# Altium schematic sheet 原理图.SchDoc
size A2
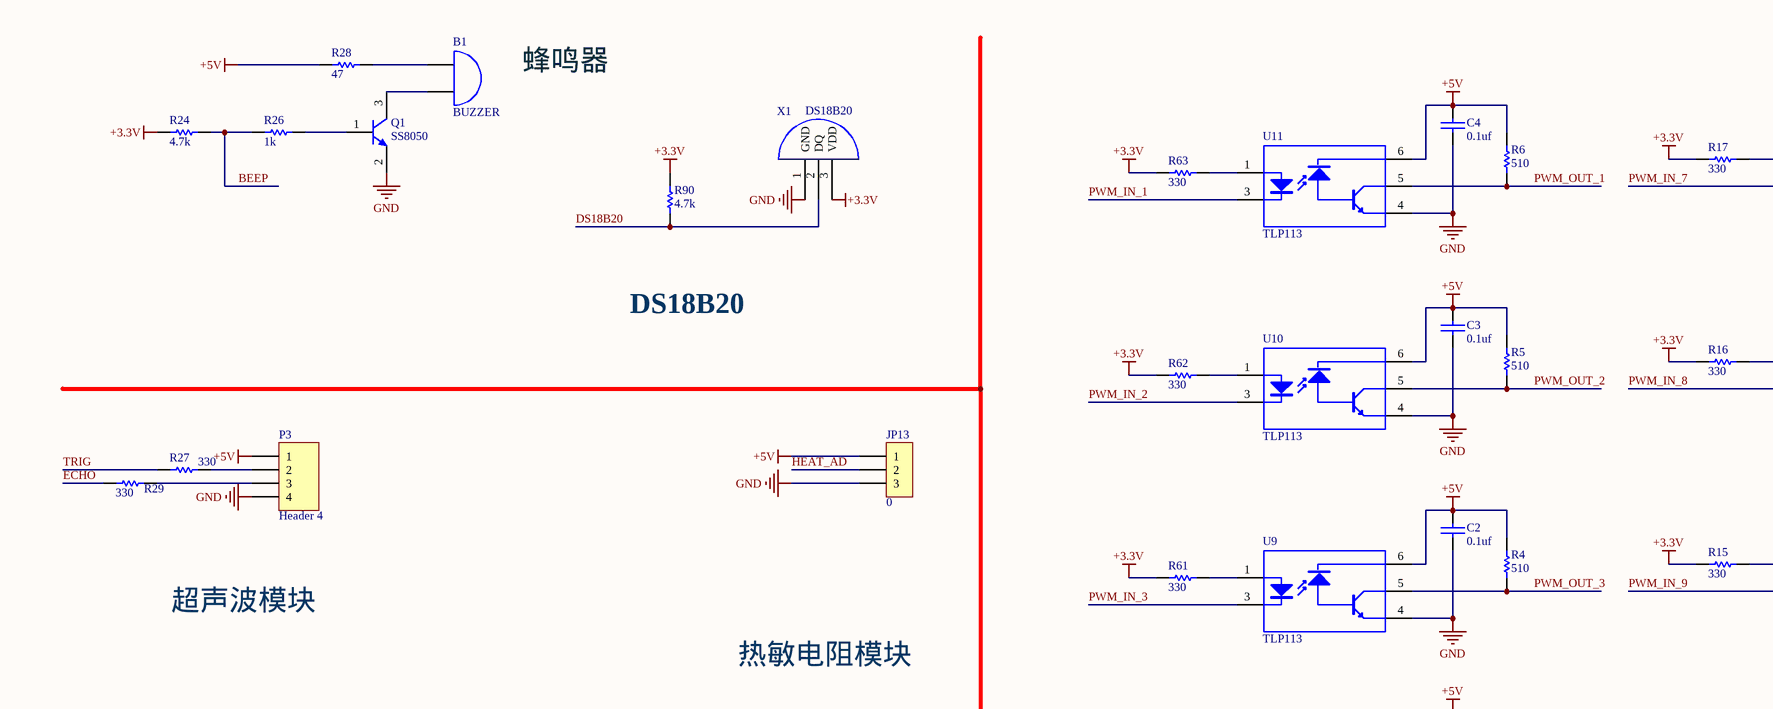
[diagram p0: 原理图.SchDoc, top left]
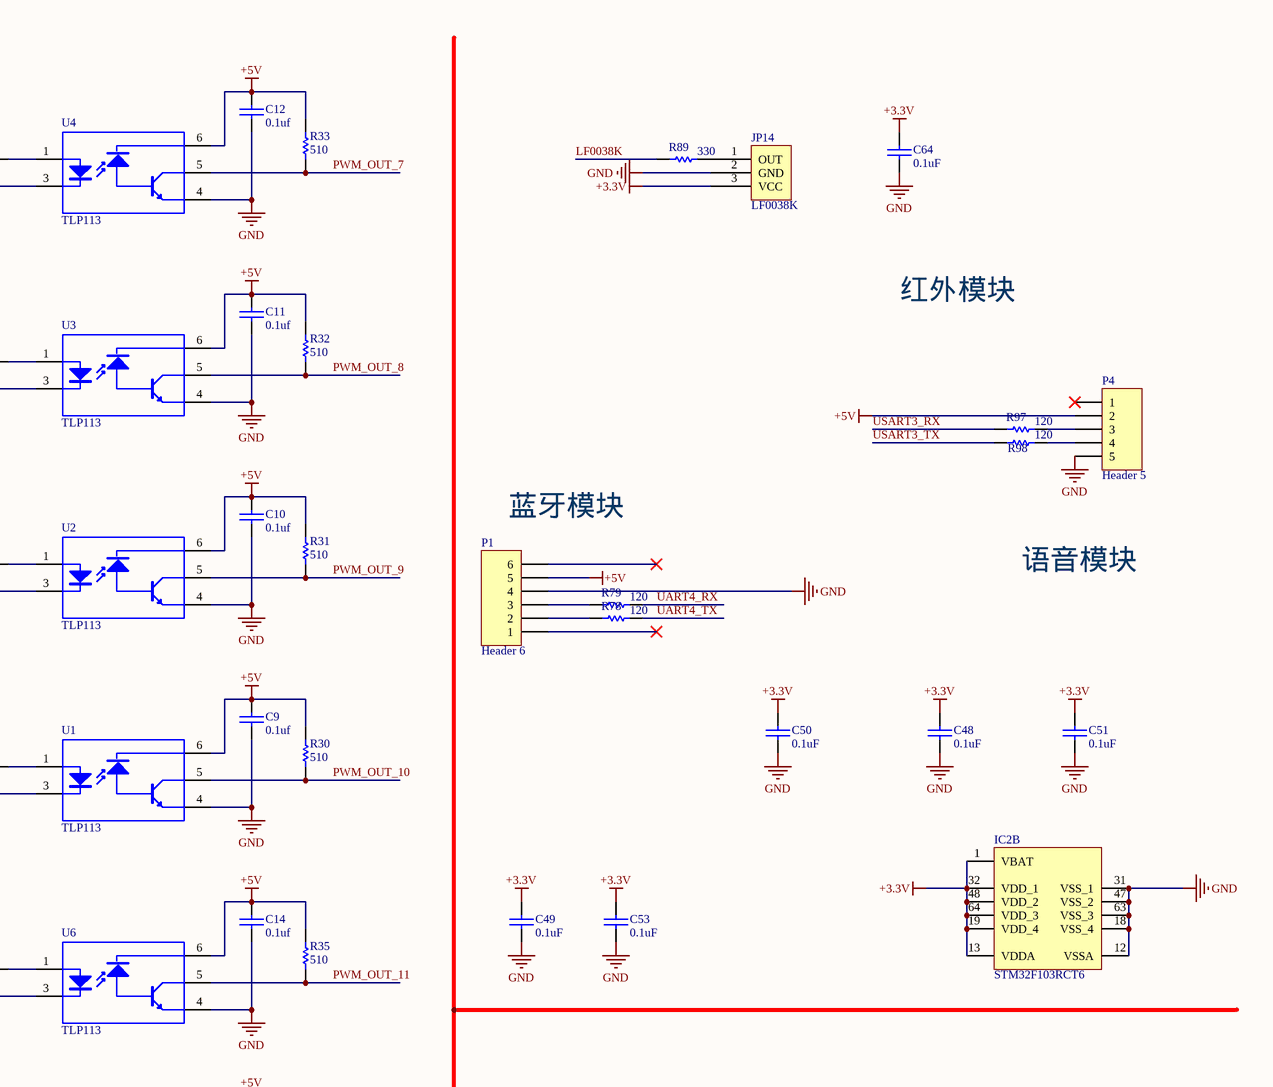
[diagram p1: 原理图.SchDoc, top right]
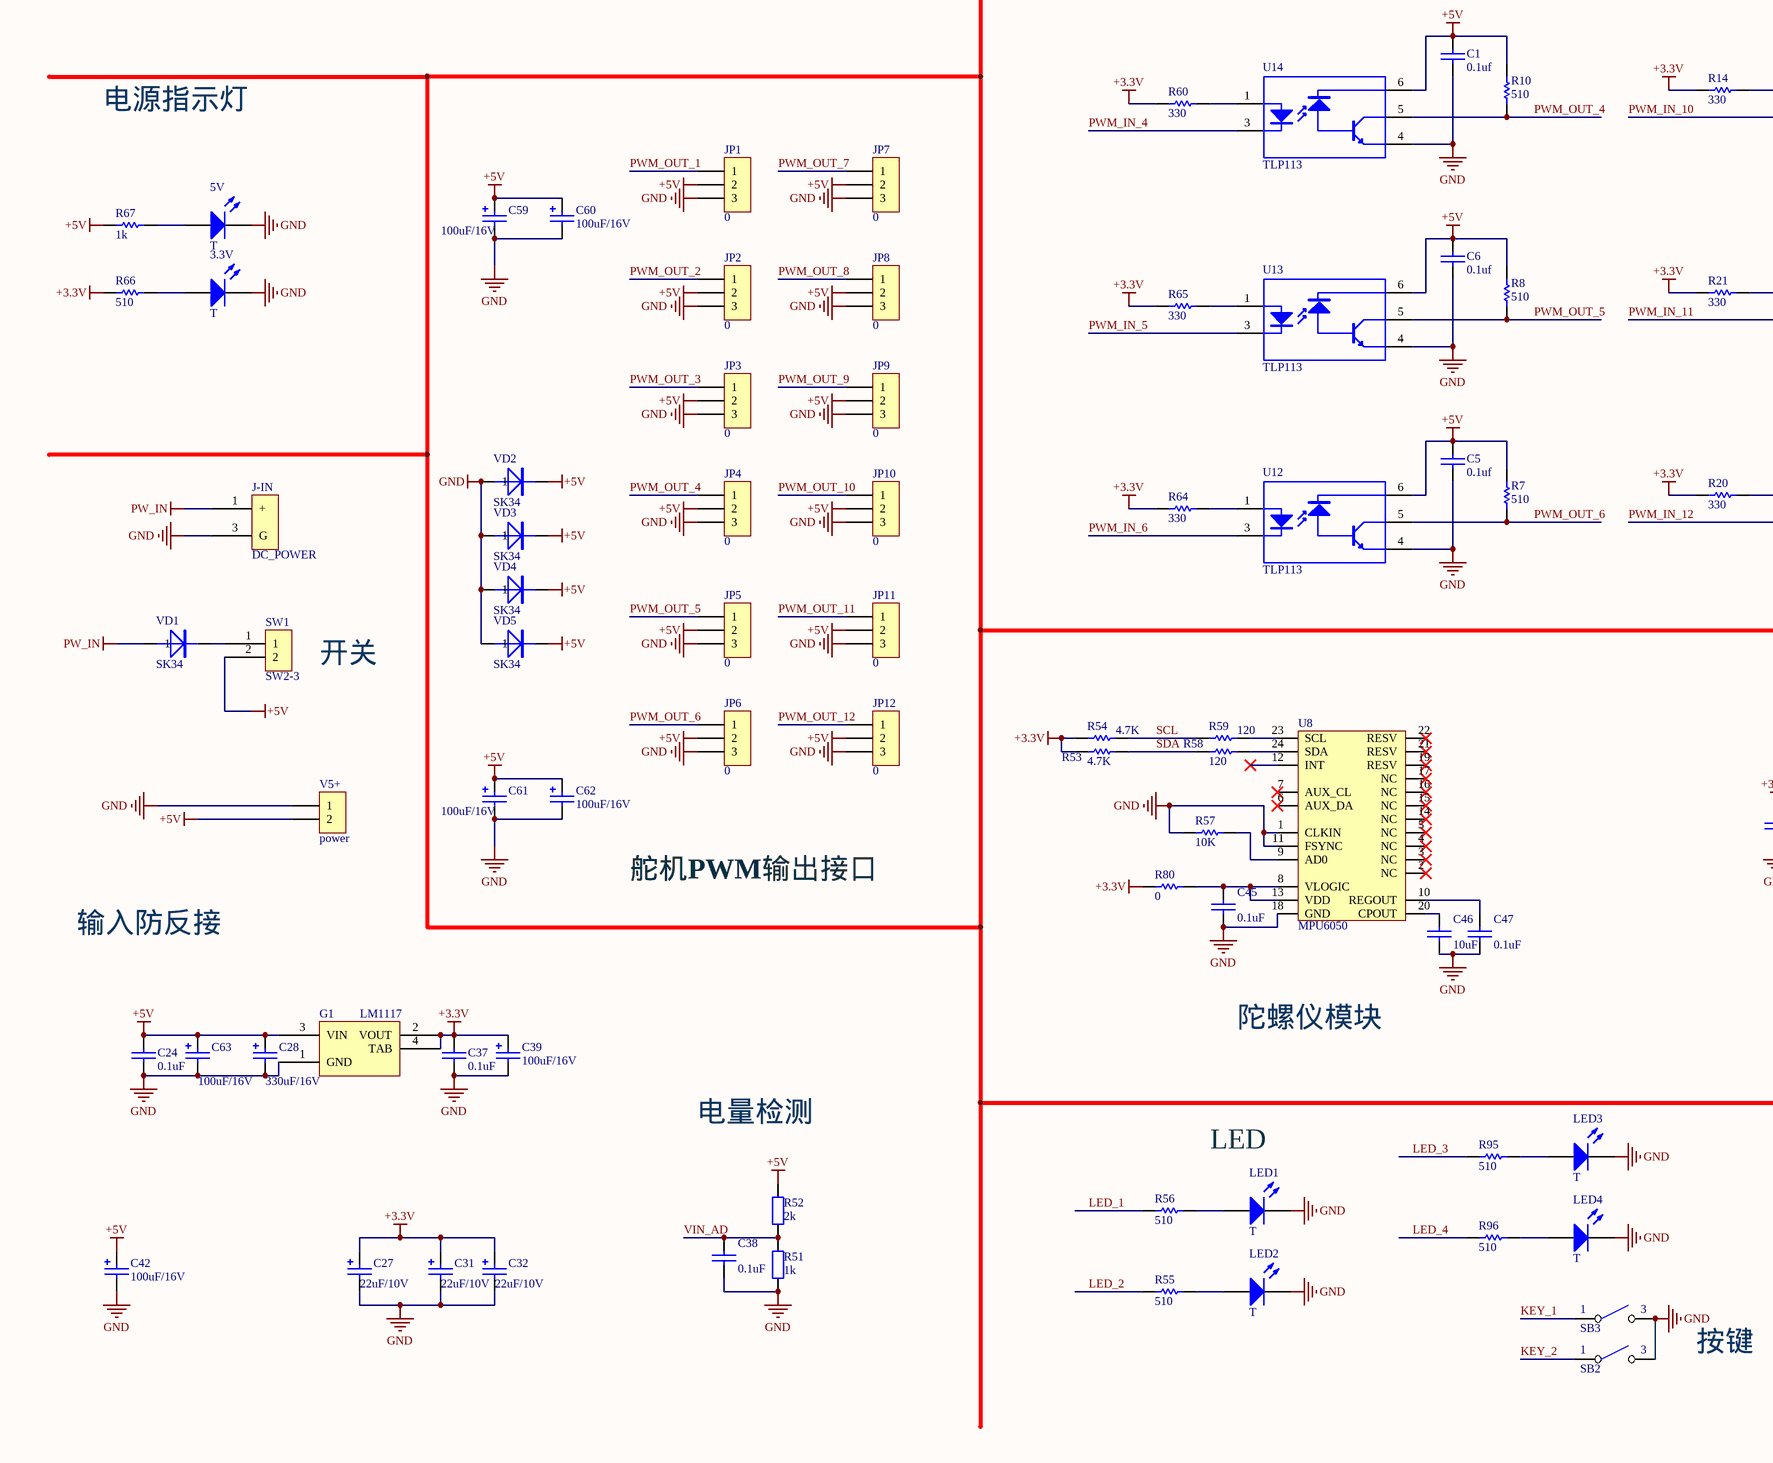
[diagram p2: 原理图.SchDoc, bottom left]
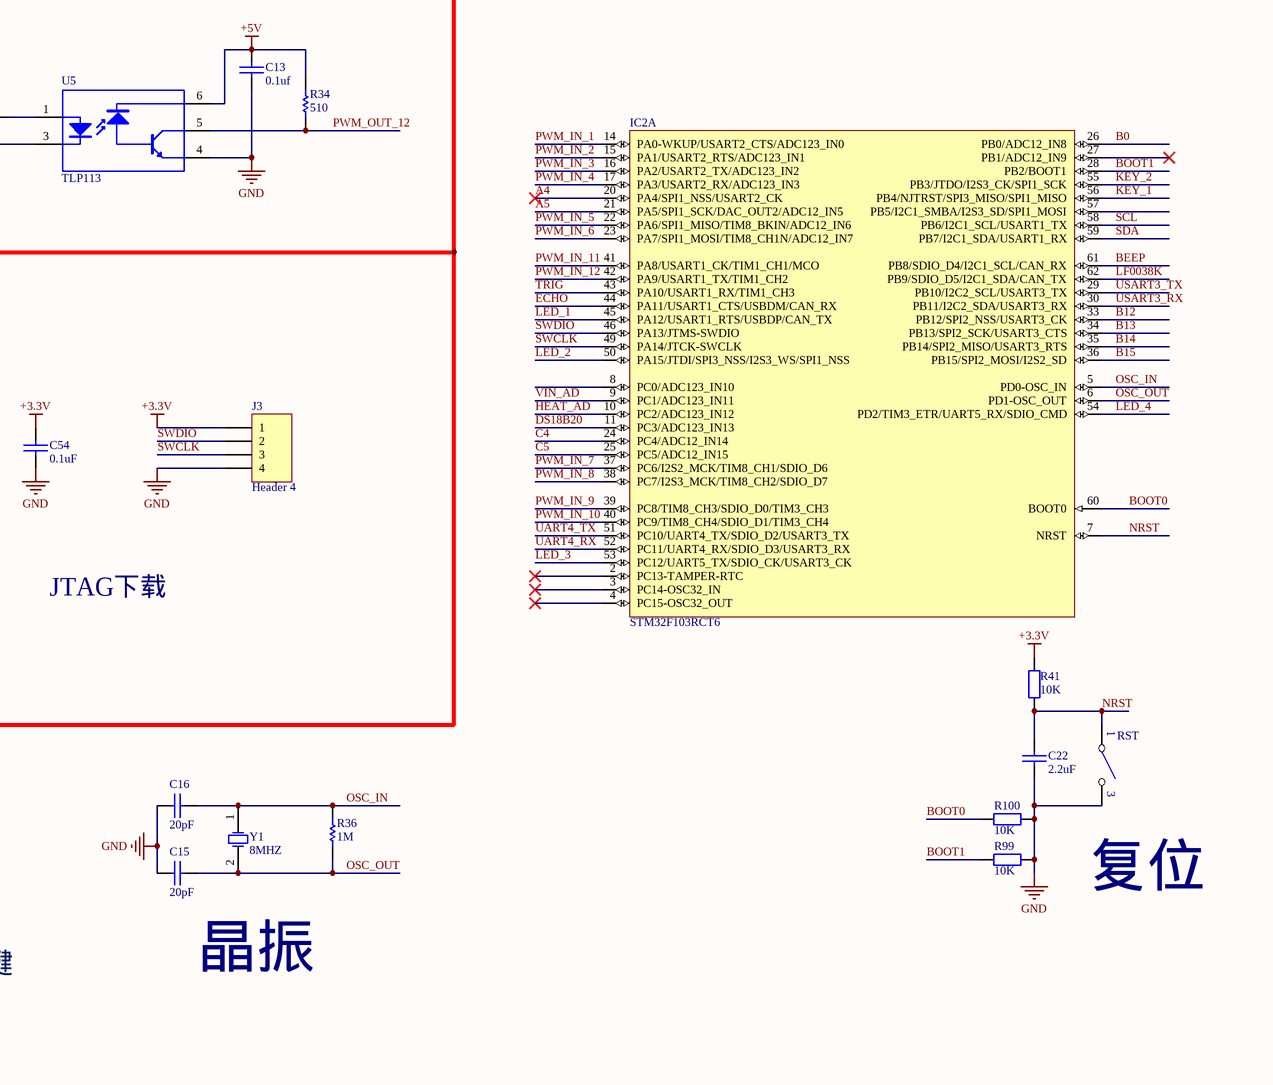
[diagram p3: 原理图.SchDoc, bottom right]

## Parts
3.3V  T  [LED-0805]
5V  T  [LED-0805]
B1  BUZZER  [BUZZER-5V]
C1  0.1uf  [0805]
C2  0.1uf  [0805]
C3  0.1uf  [0805]
C4  0.1uf  [0805]
C5  0.1uf  [0805]
C6  0.1uf  [0805]
C9  0.1uf  [0805]
C10  0.1uf  [0805]
C11  0.1uf  [0805]
C12  0.1uf  [0805]
C13  0.1uf  [0805]
C14  0.1uf  [0805]
C15  20pF  [0805]
C16  20pF  [0805]
C22  2.2uF  [0805]
C24  0.1uF  [0805]
C27  22uF/10V  [3528-B]
C28  330uF/16V  [CSMD-100U50V]
C31  22uF/10V  [3528-B]
C32  22uF/10V  [3528-B]
C37  0.1uF  [0805]
C38  0.1uF  [0805]
C39  100uF/16V  [7243-D]
C42  100uF/16V  [7243-D]
C45  0.1uF  [0805]
C46  10uF  [0805]
C47  0.1uF  [0805]
C48  0.1uF  [0805]
C49  0.1uF  [0805]
C50  0.1uF  [0805]
C51  0.1uF  [0805]
C53  0.1uF  [0805]
C54  0.1uF  [0805]
C59  100uF/16V  [7243-D]
C60  100uF/16V  [7243-D]
C61  100uF/16V  [7243-D]
C62  100uF/16V  [7243-D]
C63  100uF/16V  [7243-D]
C64  0.1uF  [0805]
G1  LM1117  [SOT223-2.3]
IC2  STM32F103RCT6  [TQFP64-0.5]  (parts A,B of 2)
J3  Header 4  [HDR1X4]
J-IN  DC_POWER  [DC-005 5.5-2.1]
JP1  0  [SIP3-2.54]
JP2  0  [SIP3-2.54]
JP3  0  [SIP3-2.54]
JP4  0  [SIP3-2.54]
JP5  0  [SIP3-2.54]
JP6  0  [SIP3-2.54]
JP7  0  [SIP3-2.54]
JP8  0  [SIP3-2.54]
JP9  0  [SIP3-2.54]
JP10  0  [SIP3-2.54]
JP11  0  [SIP3-2.54]
JP12  0  [SIP3-2.54]
JP13  0  [SIP3-2.54]
JP14  LF0038K  [LF0038K]
LED1  T  [LED-0805]
LED2  T  [LED-0805]
LED3  T  [LED-0805]
LED4  T  [LED-0805]
P1  Header 6  [HDR1X6]
P3  Header 4  [HDR1X4]
P4  Header 5  [HDR1X5]
Q1  SS8050  [SOT-23]
R4  510  [0805]
R5  510  [0805]
R6  510  [0805]
R7  510  [0805]
R8  510  [0805]
R10  510  [0805]
R14  330  [0805]
R15  330  [0805]
R16  330  [0805]
R17  330  [0805]
R20  330  [0805]
R21  330  [0805]
R24  4.7k  [0805]
R26  1k  [0805]
R27  330  [0805]
R28  47  [0805]
R29  330  [0805]
R30  510  [0805]
R31  510  [0805]
R32  510  [0805]
R33  510  [0805]
R34  510  [0805]
R35  510  [0805]
R36  1M  [0805]
R41  10K  [0805]
R51  1k  [0805]
R52  2k  [0805]
R53  4.7K  [0805]
R54  4.7K  [0805]
R55  510  [0805]
R56  510  [0805]
R57  10K  [0805]
R58  120  [0805]
R59  120  [0805]
R60  330  [0805]
R61  330  [0805]
R62  330  [0805]
R63  330  [0805]
R64  330  [0805]
R65  330  [0805]
R66  510  [0805]
R67  1k  [0805]
R78  120  [0805]
R79  120  [0805]
R80  0  [0805]
R89  330  [0805]
R90  4.7k  [0805]
R95  510  [0805]
R96  510  [0805]
R97  120  [0805]
R98  120  [0805]
R99  10K  [0805]
R100  10K  [0805]
RST  Config  [KEY-SMD]  (value not drawn)
SB2  Config  [KEY-SMD]  (value not drawn)
SB3  Config  [KEY-SMD]  (value not drawn)
SW1  SW2-3  [SS-12F44(1P2T)]
U1  TLP113  [MFSOP6-5]
U2  TLP113  [MFSOP6-5]
U3  TLP113  [MFSOP6-5]
U4  TLP113  [MFSOP6-5]
U5  TLP113  [MFSOP6-5]
U6  TLP113  [MFSOP6-5]
U8  MPU6050  [QFN24]
U9  TLP113  [MFSOP6-5]
U10  TLP113  [MFSOP6-5]
U11  TLP113  [MFSOP6-5]
U12  TLP113  [MFSOP6-5]
U13  TLP113  [MFSOP6-5]
U14  TLP113  [MFSOP6-5]
V5+  power  [MKDS2-5.08]
VD1  SK34  [SK34-DIODE]
VD2  SK34  [SK34-DIODE]
VD3  SK34  [SK34-DIODE]
VD4  SK34  [SK34-DIODE]
VD5  SK34  [SK34-DIODE]
X1  DS18B20  [DS18B20TR]
Y1  8MHZ  [CRYSTAL-2PIN]

## Nets
+3.3V: C27.1 C31.1 C32.1 C37.1 C39.1 C48.1 C49.1 C50.1 C51.1 C53.1 C54.1 C64.1 G1.2(VOUT) G1.4(TAB) IC2.1(VBAT) IC2.13(VDDA) IC2.19(VDD_4) IC2.32(VDD_1) IC2.48(VDD_2) IC2.64(VDD_3) J3.1 JP14.3(VCC) R14.1 R15.1 R16.1 R17.1 R20.1 R21.1 R24.1 R41.2 R53.1 R54.1 R60.1 R61.1 R62.1 R63.1 R64.1 R65.1 R66.1 R80.1 R90.2 X1.3(VDD)
+5V: C1.1 C2.1 C3.1 C4.1 C5.1 C6.1 C9.1 C10.1 C11.1 C12.1 C13.1 C14.1 C24.1 C28.1 C42.1 C59.1 C60.1 C61.1 C62.1 C63.1 G1.3(VIN) JP1.2 JP2.2 JP3.2 JP4.2 JP5.2 JP6.2 JP7.2 JP8.2 JP9.2 JP10.2 JP11.2 JP12.2 JP13.1 P1.5 P3.1 P4.2 R4.2 R5.2 R6.2 R7.2 R8.2 R10.2 R28.1 R30.2 R31.2 R32.2 R33.2 R34.2 R35.2 R52.1 R67.1 SW1.2 U1.6(VCC) U2.6(VCC) U3.6(VCC) U4.6(VCC) U5.6(VCC) U6.6(VCC) U9.6(VCC) U10.6(VCC) U11.6(VCC) U12.6(VCC) U13.6(VCC) U14.6(VCC) V5+.2 VD2.2 VD3.2 VD4.2 VD5.2
GND: 3.3V.2(K) 5V.2(K) C1.2 C2.2 C3.2 C4.2 C5.2 C6.2 C9.2 C10.2 C11.2 C12.2 C13.2 C14.2 C15.1 C16.1 C22.2 C24.2 C27.2 C28.2 C31.2 C32.2 C37.2 C38.2 C39.2 C42.2 C45.2 C46.2 C47.2 C48.2 C49.2 C50.2 C51.2 C53.2 C54.2 C59.2 C60.2 C61.2 C62.2 C63.2 C64.2 G1.1(GND) IC2.12(VSSA) IC2.18(VSS_4) IC2.31(VSS_1) IC2.47(VSS_2) IC2.63(VSS_3) J3.4 J-IN.3(G) JP1.3 JP2.3 JP3.3 JP4.3 JP5.3 JP6.3 JP7.3 JP8.3 JP9.3 JP10.3 JP11.3 JP12.3 JP13.3 JP14.2(GND) LED1.2(K) LED2.2(K) LED3.2(K) LED4.2(K) P1.4 P3.4 P4.5 Q1.2(E) R51.2 R57.1 R99.1 R100.1 RST.2(NO) SB2.2(NO) SB3.2(NO) U1.4(GND) U2.4(GND) U3.4(GND) U4.4(GND) U5.4(GND) U6.4(GND) U8.1(CLKIN) U8.11(FSYNC) U8.18(GND) U9.4(GND) U10.4(GND) U11.4(GND) U12.4(GND) U13.4(GND) U14.4(GND) V5+.1 VD2.1 VD3.1 VD4.1 VD5.1 X1.1(GND)
PW_IN: J-IN.1(+) VD1.1
A4: IC2.20(PA4/SPI1_NSS/USART2_CK)
A5: IC2.21(PA5/SPI1_SCK/DAC_OUT2/ADC12_IN5)
B0: IC2.26(PB0/ADC12_IN8)
B12: IC2.33(PB12/SPI2_NSS/USART3_CK)
B13: IC2.34(PB13/SPI2_SCK/USART3_CTS)
B14: IC2.35(PB14/SPI2_MISO/USART3_RTS)
B15: IC2.36(PB15/SPI2_MOSI/I2S2_SD)
BEEP: IC2.61(PB8/SDIO_D4/I2C1_SCL/CAN_RX) R24.2 R26.1
BOOT0: IC2.60(BOOT0) R100.2
BOOT1: IC2.28(PB2/BOOT1) R99.2
C4: IC2.24(PC4/ADC12_IN14)
C5: IC2.25(PC5/ADC12_IN15)
DS18B20: IC2.11(PC3/ADC123_IN13) R90.1 X1.2(DQ)
ECHO: IC2.44(PA11/USART1_CTS/USBDM/CAN_RX) R29.1
HEAT_AD: IC2.10(PC2/ADC123_IN12) JP13.2
KEY_1: IC2.56(PB4/NJTRST/SPI3_MISO/SPI1_MISO) SB3.1(COMMON)
KEY_2: IC2.55(PB3/JTDO/I2S3_CK/SPI1_SCK) SB2.1(COMMON)
LED_1: IC2.45(PA12/USART1_RTS/USBDP/CAN_TX) R56.1
LED_2: IC2.50(PA15/JTDI/SPI3_NSS/I2S3_WS/SPI1_NSS) R55.1
LED_3: IC2.53(PC12/UART5_TX/SDIO_CK/USART3_CK) R95.1
LED_4: IC2.54(PD2/TIM3_ETR/UART5_RX/SDIO_CMD) R96.1
LF0038K: IC2.62(PB9/SDIO_D5/I2C1_SDA/CAN_TX) R89.1
NRST: C22.1 IC2.7(NRST) R41.1 RST.1(COMMON)
OSC_IN: C16.2 IC2.5(PD0-OSC_IN) R36.2 Y1.1(OSC1)
OSC_OUT: C15.2 IC2.6(PD1-OSC_OUT) R36.1 Y1.2(OSC2)
PWM_IN_1: IC2.14(PA0-WKUP/USART2_CTS/ADC123_IN0) U11.3(K)
PWM_IN_2: IC2.15(PA1/USART2_RTS/ADC123_IN1) U10.3(K)
PWM_IN_3: IC2.16(PA2/USART2_TX/ADC123_IN2) U9.3(K)
PWM_IN_4: IC2.17(PA3/USART2_RX/ADC123_IN3) U14.3(K)
PWM_IN_5: IC2.22(PA6/SPI1_MISO/TIM8_BKIN/ADC12_IN6) U13.3(K)
PWM_IN_6: IC2.23(PA7/SPI1_MOSI/TIM8_CH1N/ADC12_IN7) U12.3(K)
PWM_IN_7: IC2.37(PC6/I2S2_MCK/TIM8_CH1/SDIO_D6) U4.3(K)
PWM_IN_8: IC2.38(PC7/I2S3_MCK/TIM8_CH2/SDIO_D7) U3.3(K)
PWM_IN_9: IC2.39(PC8/TIM8_CH3/SDIO_D0/TIM3_CH3) U2.3(K)
PWM_IN_10: IC2.40(PC9/TIM8_CH4/SDIO_D1/TIM3_CH4) U1.3(K)
PWM_IN_11: IC2.41(PA8/USART1_CK/TIM1_CH1/MCO) U6.3(K)
PWM_IN_12: IC2.42(PA9/USART1_TX/TIM1_CH2) U5.3(K)
PWM_OUT_1: JP1.1 R6.1 U11.5(C)
PWM_OUT_2: JP2.1 R5.1 U10.5(C)
PWM_OUT_3: JP3.1 R4.1 U9.5(C)
PWM_OUT_4: JP4.1 R10.1 U14.5(C)
PWM_OUT_5: JP5.1 R8.1 U13.5(C)
PWM_OUT_6: JP6.1 R7.1 U12.5(C)
PWM_OUT_7: JP7.1 R33.1 U4.5(C)
PWM_OUT_8: JP8.1 R32.1 U3.5(C)
PWM_OUT_9: JP9.1 R31.1 U2.5(C)
PWM_OUT_10: JP10.1 R30.1 U1.5(C)
PWM_OUT_11: JP11.1 R35.1 U6.5(C)
PWM_OUT_12: JP12.1 R34.1 U5.5(C)
SCL: IC2.58(PB6/I2C1_SCL/USART1_TX) R54.2 R59.1
SDA: IC2.59(PB7/I2C1_SDA/USART1_RX) R53.2 R58.1
SWCLK: IC2.49(PA14/JTCK-SWCLK) J3.3
SWDIO: IC2.46(PA13/JTMS-SWDIO) J3.2
TRIG: IC2.43(PA10/USART1_RX/TIM1_CH3) R27.1
UART4_RX: IC2.52(PC11/UART4_RX/SDIO_D3/USART3_RX) R79.2
UART4_TX: IC2.51(PC10/UART4_TX/SDIO_D2/USART3_TX) R78.2
USART3_RX: IC2.30(PB11/I2C2_SDA/USART3_RX) R97.1
USART3_TX: IC2.29(PB10/I2C2_SCL/USART3_TX) R98.1
VIN_AD: C38.1 IC2.9(PC1/ADC123_IN11) R51.1 R52.2
Net3.3V_1: 3.3V.1(A) R66.2
Net5V_1: 5V.1(A) R67.2
NetB1_1: B1.1(A) R28.2
NetB1_2: B1.2(B) Q1.3(C)
NetC45_1: C45.1 R80.2 U8.8(VLOGIC) U8.13(VDD)
NetC46_1: C46.1 U8.20(CPOUT)
NetC47_1: C47.1 U8.10(REGOUT)
NetJP14_1: JP14.1(OUT) R89.2
NetLED1_1: LED1.1(A) R56.2
NetLED2_1: LED2.1(A) R55.2
NetLED3_1: LED3.1(A) R95.2
NetLED4_1: LED4.1(A) R96.2
NetP1_2: P1.2 R78.1
NetP1_3: P1.3 R79.1
NetP3_2: P3.2 R27.2
NetP3_3: P3.3 R29.2
NetP4_3: P4.3 R97.2
NetP4_4: P4.4 R98.2
NetQ1_1: Q1.1(B) R26.2
NetR14_2: R14.2 U1.1(A)
NetR15_2: R15.2 U2.1(A)
NetR16_2: R16.2 U3.1(A)
NetR17_2: R17.2 U4.1(A)
NetR20_2: R20.2 U5.1(A)
NetR21_2: R21.2 U6.1(A)
NetR57_2: R57.2 U8.9(AD0)
NetR58_2: R58.2 U8.24(SDA)
NetR59_2: R59.2 U8.23(SCL)
NetR60_2: R60.2 U14.1(A)
NetR61_2: R61.2 U9.1(A)
NetR62_2: R62.2 U10.1(A)
NetR63_2: R63.2 U11.1(A)
NetR64_2: R64.2 U12.1(A)
NetR65_2: R65.2 U13.1(A)
NetSW1_1: SW1.1 VD1.2

Not connected (* = marked no-connect by the designer): IC2 2(PC13-TAMPER-RTC)* 3(PC14-OSC32_IN)* 4(PC15-OSC32_OUT)* 8(PC0/ADC123_IN10) 27(PB1/ADC12_IN9)* 57(PB5/I2C1_SMBA/I2S3_SD/SPI1_MOSI); P1 1* 6*; P4 1*; U8 2(NC)* 3(NC)* 4(NC)* 5(NC)* 6(AUX_DA)* 7(AUX_CL)* 12(INT)* 14(NC)* 15(NC)* 16(NC)* 17(NC)* 19(RESV)* 21(RESV)* 22(RESV)*

## Notes on the sheet
- 蜂鸣器
- DS18B20
- 红外模块
- (near P1) 蓝牙模块
- 语音模块
- 超声波模块
- 热敏电阻模块
- 电源指示灯
- 开关
- 舵机PWM输出接口
- 输入防反接
- JTAG下载
- 陀螺仪模块
- 电量检测
- LED
- 复位
- 按键
- 晶振
- (in symbol KEY1) 3

## Library data of the parts
3.3V 5V LED1-LED4 = LED0: Typical INFRARED GaAs LED; Published: 8-Jun-2000; LatestRevisionDate: 08-Jul-2005; LatestRevisionNote: Mech Layer 1 removed.; PackageReference: LED-0; Publisher: Altium Limited; PackageDescription: LED; 2 Leads
B1 = BELL
C1-C6 C9-C16 C24 C37 C38 C45-C47 = CAP_1
C22 C48-C51 C53 C54 C64 = CAP
C27 C28 C31 C32 C39 C42 C59-C63 = ELECTRO1: Capacitor
IC2 = STM32F103RCT6: ARM Cortex-M3 32-bit MCU, 256 KB Flash, 48 KB Internal RAM, 51 I/Os, 64-pin LQFP, -40 to 85 degC, Tray; A/D Converter: 3x12-bit (16 Channel); D/A Converter: 2x12-bit (2 Channel); FLASH Size (Prog) (kB): 256; I/Os (High Current): 51; Internal RAM Size (kB): 48; Operating Frequency(F) (Processor speed) (MHz): 72; Supply Voltage(Vcc) min (V): 2; DatasheetVersion: Rev. 8; PackageVersion: Rev. 4, 06/2013; PackageReference: LQFP64; PackageDescription: 64-Pin Low Profile Quad Flat Package, 10 x 10 mm Body, 0.5 mm Pitch; Supplier 1: Digi-Key; Supplier Part Number 1: 497-9033-ND; Supplier 2: Newark; Supplier Part Number 2: 01P4099; Supplier 3: Newark; Supplier Part Number 3: 57P1227; Supplier 4: Mouser; Supplier Part Number 4: 511-STM32F103RCT6; Core: ARM Cortex-M3; Packing: Tray; Mounting Technology: Surface Mount; PartNumber: STM32F103RCT6; ComponentLink1Description: Manufacturer URL; ComponentLink1URL: http://www.st.com/web/en/home.html; ComponentLink2Description: Datasheet; ComponentLink2URL: http://www.st.com/st-web-ui/static/active/en/resource/technical/document/datasheet/CD00191185.pdf; ComponentLink3Description: Package Specification; ComponentLink3URL: http://www.st.com/st-web-ui/static/active/en/resource/technical/document/datasheet/DM00037051.pdf
J3 P3 = Header 4: Header, 4-Pin; LatestRevisionDate: 17-Jul-2002; LatestRevisionNote: Re-released for DXP Platform.; Publisher: Altium Limited
JP1-JP13 = CON3: Connector
P1 = Header 6: Header, 6-Pin; LatestRevisionDate: 17-Jul-2002; LatestRevisionNote: Re-released for DXP Platform.; Publisher: Altium Limited
P4 = Header 5: Header, 5-Pin; LatestRevisionDate: 17-Jul-2002; LatestRevisionNote: Re-released for DXP Platform.; Publisher: Altium Limited
Q1 = SS8050: NPN贴片三极管; Published: 8-Jun-2000; LatestRevisionDate: 15-Jan-2003; LatestRevisionNote: PCB Footprint 'BCY-W3/D4.7' replaced; DatasheetDocument: 1997; PackageDocument: Sep-1998; PackageReference: TO-92A; Publisher: Altium Limited; Code_JEDEC: TO-92A; ComponentLink1Description: Manufacturer Link; ComponentLink1URL: http://www.fairchildsemi.com/; ComponentLink2Description: Datasheet; ComponentLink2URL: http://www.fairchildsemi.com/ds/2N%2F2N3904.pdf
R4-R8 R10 R14-R17 R20 R21 R24 R26-R35 R53-R67 R78-R80 R89 R90 R95-R98 = Res1: Resistor; Value: 1M; Published: 8-Jun-2000; LatestRevisionDate: 17-Jul-2002; LatestRevisionNote: Re-released for DXP Platform.; PackageReference: AXIAL-0.3; Publisher: Altium Limited; PackageDescription: Axial Device, Thru-Hole; 2 Leads; 0.3 in Pin Spacing
R36 = Res1: Resistor; Published: 8-Jun-2000; LatestRevisionDate: 17-Jul-2002; LatestRevisionNote: Re-released for DXP Platform.; PackageReference: AXIAL-0.3; Publisher: Altium Limited; PackageDescription: Axial Device, Thru-Hole; 2 Leads; 0.3 in Pin Spacing; Value: 1M
R41 R99 R100 = RES1: Resistor; Published: 8-Jun-2000; LatestRevisionDate: 17-Jul-2002; LatestRevisionNote: Re-released for DXP Platform.; PackageReference: AXIAL-0.4; Publisher: Altium Limited; Value: 10K
R51 = Res2: Resistor; Published: 8-Jun-2000; LatestRevisionDate: 17-Jul-2002; LatestRevisionNote: Re-released for DXP Platform.; PackageReference: AXIAL-0.4; Publisher: Altium Limited; PackageDescription: Axial Device, Thru-Hole; 2 Leads; 0.4 in Pin Spacing; Value: 1K
R52 = Res2: Resistor; Value: 1K; Published: 8-Jun-2000; LatestRevisionDate: 17-Jul-2002; LatestRevisionNote: Re-released for DXP Platform.; PackageReference: AXIAL-0.4; Publisher: Altium Limited; PackageDescription: Axial Device, Thru-Hole; 2 Leads; 0.4 in Pin Spacing
RST SB2 SB3 = KEY1
U1-U6 U9-U14 = TLP113: Optoisolator
U8 = MPU6050: 9轴运动处理传感器
V5+ = CON2: Connector
VD1-VD5 = SK34-DIODE
Y1 = XTAL_1: Crystal Oscillator; Published: 8-Jun-2000; LatestRevisionDate: 17-Jul-2002; LatestRevisionNote: Re-released for DXP Platform.; PackageReference: R38; Publisher: Altium Limited; PackageDescription: Crystal, Thru-Hole; 2 Leads; Body 3.1 x 8.2 mm (Dia.xH)